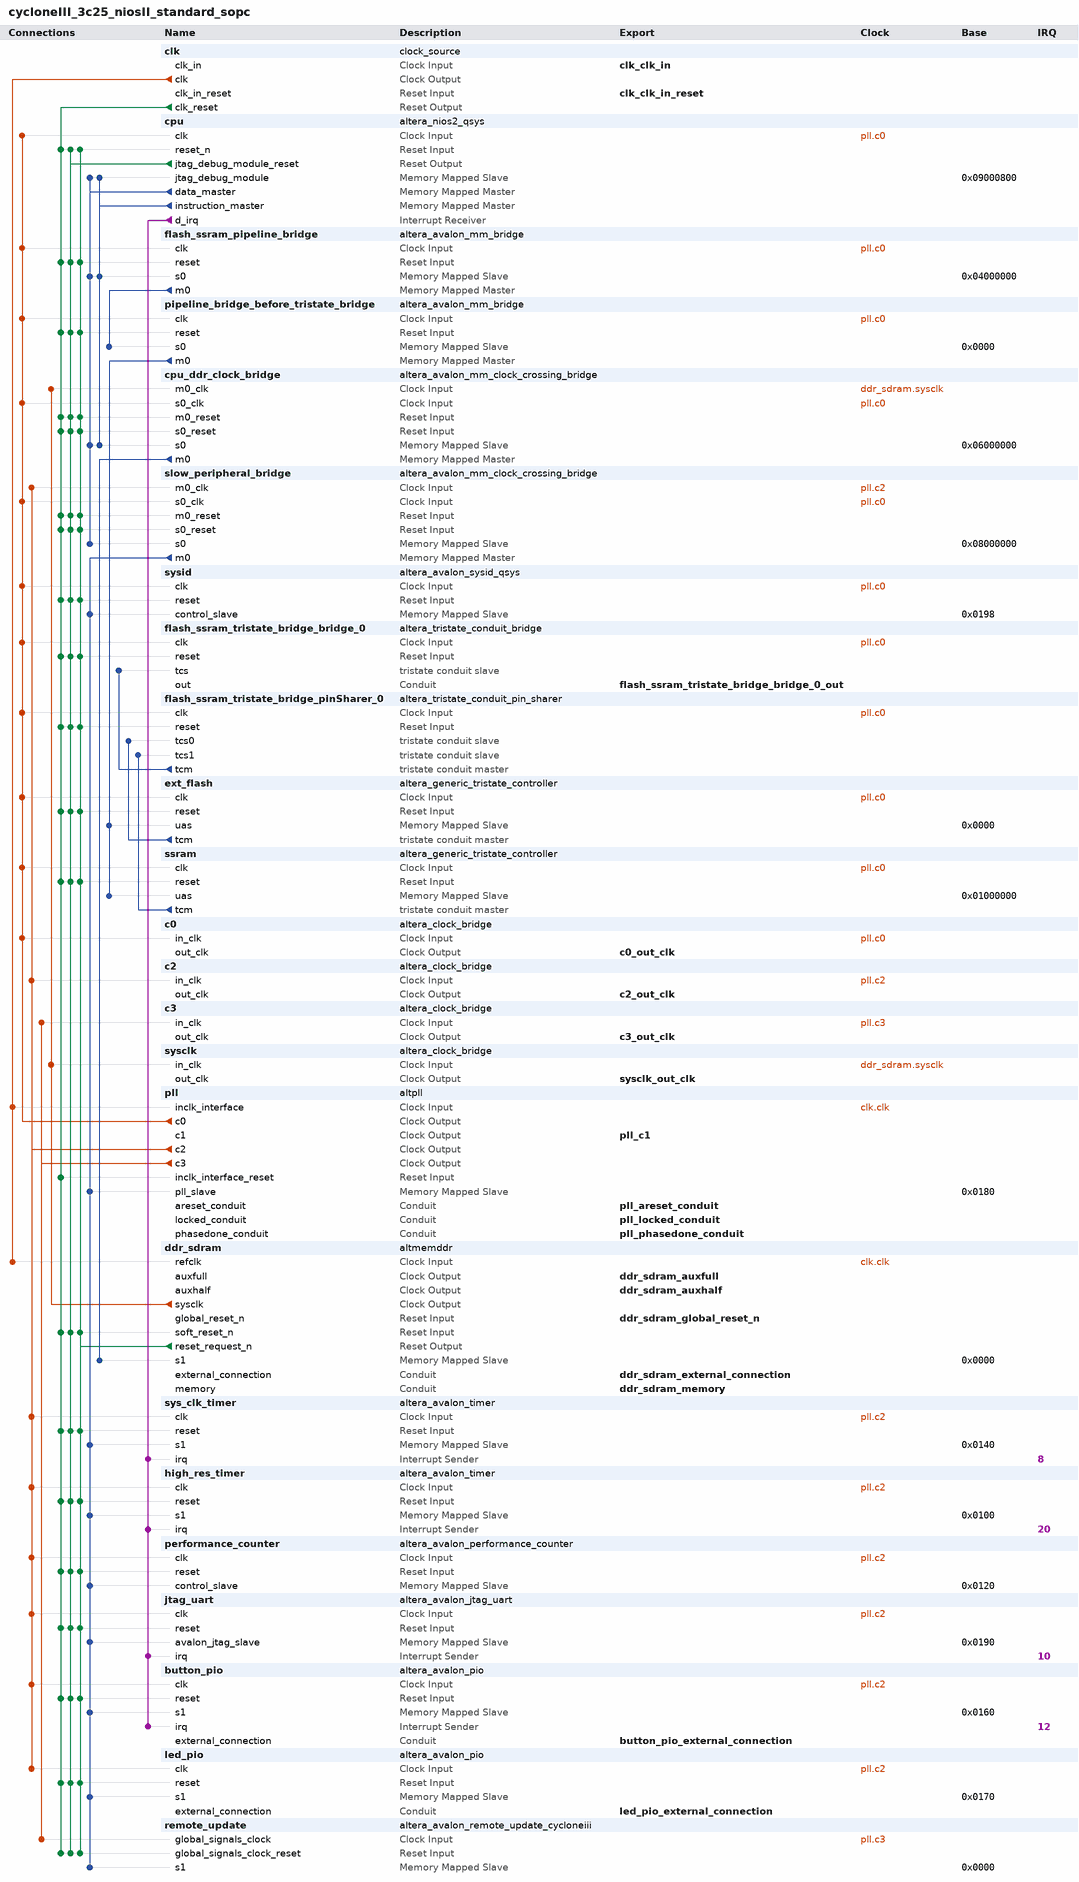
[diagram p0: system contents]
# Platform Designer (Qsys) system cycloneIII_3c25_niosII_standard_sopc
# Parameters at their usual value, and those the tool derives, are not listed.
package require -exact qsys 11.1
create_system cycloneIII_3c25_niosII_standard_sopc
set_project_property DEVICE_FAMILY CYCLONEIII

add_instance clk clock_source 11.1
set_instance_parameter_value clk clockFrequency 50000000

add_instance cpu altera_nios2_qsys 11.1
set_instance_parameter_value cpu manuallyAssignCpuID false
set_instance_parameter_value cpu resetSlave ext_flash.uas
set_instance_parameter_value cpu exceptionSlave ssram.uas
set_instance_parameter_value cpu breakSlave cpu.jtag_debug_module
set_instance_parameter_value cpu impl Fast
set_instance_parameter_value cpu icache_size 4096

add_instance flash_ssram_pipeline_bridge altera_avalon_mm_bridge 11.1
set_instance_parameter_value flash_ssram_pipeline_bridge DATA_WIDTH 32
set_instance_parameter_value flash_ssram_pipeline_bridge ADDRESS_WIDTH 25
set_instance_parameter_value flash_ssram_pipeline_bridge ADDRESS_UNITS SYMBOLS
set_instance_parameter_value flash_ssram_pipeline_bridge MAX_PENDING_RESPONSES 10

add_instance pipeline_bridge_before_tristate_bridge altera_avalon_mm_bridge 11.1
set_instance_parameter_value pipeline_bridge_before_tristate_bridge DATA_WIDTH 32
set_instance_parameter_value pipeline_bridge_before_tristate_bridge ADDRESS_WIDTH 25
set_instance_parameter_value pipeline_bridge_before_tristate_bridge ADDRESS_UNITS SYMBOLS
set_instance_parameter_value pipeline_bridge_before_tristate_bridge MAX_PENDING_RESPONSES 7

add_instance cpu_ddr_clock_bridge altera_avalon_mm_clock_crossing_bridge 11.1
set_instance_parameter_value cpu_ddr_clock_bridge DATA_WIDTH 32
set_instance_parameter_value cpu_ddr_clock_bridge ADDRESS_WIDTH 25
set_instance_parameter_value cpu_ddr_clock_bridge MAX_BURST_SIZE 1
set_instance_parameter_value cpu_ddr_clock_bridge COMMAND_FIFO_DEPTH 8
set_instance_parameter_value cpu_ddr_clock_bridge RESPONSE_FIFO_DEPTH 64
set_instance_parameter_value cpu_ddr_clock_bridge MASTER_SYNC_DEPTH 3
set_instance_parameter_value cpu_ddr_clock_bridge SLAVE_SYNC_DEPTH 3

add_instance slow_peripheral_bridge altera_avalon_mm_clock_crossing_bridge 11.1
set_instance_parameter_value slow_peripheral_bridge DATA_WIDTH 32
set_instance_parameter_value slow_peripheral_bridge ADDRESS_WIDTH 9
set_instance_parameter_value slow_peripheral_bridge MAX_BURST_SIZE 1
set_instance_parameter_value slow_peripheral_bridge COMMAND_FIFO_DEPTH 16
set_instance_parameter_value slow_peripheral_bridge RESPONSE_FIFO_DEPTH 64
set_instance_parameter_value slow_peripheral_bridge MASTER_SYNC_DEPTH 3
set_instance_parameter_value slow_peripheral_bridge SLAVE_SYNC_DEPTH 3

add_instance sysid altera_avalon_sysid_qsys 11.1
set_instance_parameter_value sysid id 0

add_instance flash_ssram_tristate_bridge_bridge_0 altera_tristate_conduit_bridge 11.1

add_instance flash_ssram_tristate_bridge_pinSharer_0 altera_tristate_conduit_pin_sharer 11.1
set_instance_parameter_value flash_ssram_tristate_bridge_pinSharer_0 NUM_INTERFACES 2
set_instance_parameter_value flash_ssram_tristate_bridge_pinSharer_0 MODULE_ORIGIN_LIST ssram.tcm,ssram.tcm,ssram.tcm,ssram.tcm,ssram.tcm,ssram.tcm,ssram.tcm,ssram.tcm,ext_flash.tcm,ext_flash.tcm,ext_flash.tcm,ext_flash.tcm,ext_flash.tcm
set_instance_parameter_value flash_ssram_tristate_bridge_pinSharer_0 SIGNAL_ORIGIN_LIST chipselect_n,byteenable_n,outputenable_n,write_n,data,address,reset_n,begintransfer_n,address,read_n,write_n,data,chipselect_n
set_instance_parameter_value flash_ssram_tristate_bridge_pinSharer_0 SHARED_SIGNAL_LIST chipenable1_n_to_the_ssram,bw_n_to_the_ssram,outputenable_n_to_the_ssram,bwe_n_to_the_ssram,flash_ssram_tristate_bridge_data,flash_ssram_tristate_bridge_address,reset_n_to_the_ssram,adsc_n_to_the_ssram,flash_ssram_tristate_bridge_address,read_n_to_the_ext_flash,write_n_to_the_ext_flash,flash_ssram_tristate_bridge_data,select_n_to_the_ext_flash

add_instance ext_flash altera_generic_tristate_controller 11.1
set_instance_parameter_value ext_flash TCM_ADDRESS_W 24
set_instance_parameter_value ext_flash TCM_DATA_W 16
set_instance_parameter_value ext_flash TCM_BYTEENABLE_W 2
set_instance_parameter_value ext_flash TCM_READ_WAIT 100
set_instance_parameter_value ext_flash TCM_WRITE_WAIT 100
set_instance_parameter_value ext_flash TCM_SETUP_WAIT 25
set_instance_parameter_value ext_flash TCM_DATA_HOLD 20
set_instance_parameter_value ext_flash TCM_MAX_PENDING_READ_TRANSACTIONS 3
set_instance_parameter_value ext_flash TCM_TURNAROUND_TIME 2
set_instance_parameter_value ext_flash TCM_TIMING_UNITS 0
set_instance_parameter_value ext_flash TCM_READLATENCY 2
set_instance_parameter_value ext_flash TCM_SYMBOLS_PER_WORD 2
set_instance_parameter_value ext_flash USE_READ 1
set_instance_parameter_value ext_flash USE_BEGINTRANSFER 0
set_instance_parameter_value ext_flash USE_BYTEENABLE 0
set_instance_parameter_value ext_flash USE_OUTPUTENABLE 0
set_instance_parameter_value ext_flash ACTIVE_LOW_READ 1
set_instance_parameter_value ext_flash ACTIVE_LOW_BYTEENABLE 0
set_instance_parameter_value ext_flash ACTIVE_LOW_OUTPUTENABLE 0
set_instance_parameter_value ext_flash ACTIVE_LOW_BEGINTRANSFER 0
set_instance_parameter_value ext_flash CHIPSELECT_THROUGH_READLATENCY 0
set_instance_parameter_value ext_flash MODULE_ASSIGNMENT_KEYS embeddedsw.configuration.hwClassnameDriverSupportList,embeddedsw.configuration.hwClassnameDriverSupportDefault,embeddedsw.CMacro.SETUP_VALUE,embeddedsw.CMacro.WAIT_VALUE,embeddedsw.CMacro.HOLD_VALUE,embeddedsw.CMacro.TIMING_UNITS,embeddedsw.CMacro.SIZE,embeddedsw.memoryInfo.MEM_INIT_DATA_WIDTH,embeddedsw.memoryInfo.HAS_BYTE_LANE,embeddedsw.memoryInfo.IS_FLASH,embeddedsw.memoryInfo.GENERATE_DAT_SYM,embeddedsw.memoryInfo.GENERATE_FLASH,embeddedsw.memoryInfo.DAT_SYM_INSTALL_DIR,embeddedsw.memoryInfo.FLASH_INSTALL_DIR
set_instance_parameter_value ext_flash MODULE_ASSIGNMENT_VALUES {altera_avalon_lan91c111:altera_avalon_cfi_flash,altera_avalon_cfi_flash,25,100,20,"ns",16777216u,16,1,1,1,1,SIM_DIR,APP_DIR}
set_instance_parameter_value ext_flash INTERFACE_ASSIGNMENT_KEYS embeddedsw.configuration.isFlash,embeddedsw.configuration.isMemoryDevice,embeddedsw.configuration.isNonVolatileStorage
set_instance_parameter_value ext_flash INTERFACE_ASSIGNMENT_VALUES 1,1,1

add_instance ssram altera_generic_tristate_controller 11.1
set_instance_parameter_value ssram TCM_ADDRESS_W 20
set_instance_parameter_value ssram TCM_DATA_W 32
set_instance_parameter_value ssram TCM_BYTEENABLE_W 4
set_instance_parameter_value ssram TCM_READ_WAIT 0
set_instance_parameter_value ssram TCM_WRITE_WAIT 0
set_instance_parameter_value ssram TCM_SETUP_WAIT 0
set_instance_parameter_value ssram TCM_DATA_HOLD 0
set_instance_parameter_value ssram TCM_MAX_PENDING_READ_TRANSACTIONS 5
set_instance_parameter_value ssram TCM_TURNAROUND_TIME 2
set_instance_parameter_value ssram TCM_TIMING_UNITS 1
set_instance_parameter_value ssram TCM_READLATENCY 4
set_instance_parameter_value ssram TCM_SYMBOLS_PER_WORD 4
set_instance_parameter_value ssram USE_READ 0
set_instance_parameter_value ssram USE_BEGINTRANSFER 1
set_instance_parameter_value ssram USE_BYTEENABLE 1
set_instance_parameter_value ssram USE_OUTPUTENABLE 1
set_instance_parameter_value ssram USE_RESET_OUTPUT 1
set_instance_parameter_value ssram ACTIVE_LOW_READ 0
set_instance_parameter_value ssram ACTIVE_LOW_BYTEENABLE 1
set_instance_parameter_value ssram ACTIVE_LOW_OUTPUTENABLE 1
set_instance_parameter_value ssram ACTIVE_LOW_BEGINTRANSFER 1
set_instance_parameter_value ssram ACTIVE_LOW_RESET_OUTPUT 1
set_instance_parameter_value ssram CHIPSELECT_THROUGH_READLATENCY 1
set_instance_parameter_value ssram MODULE_ASSIGNMENT_KEYS embeddedsw.configuration.hwClassnameDriverSupportList,embeddedsw.CMacro.SRAM_MEMORY_SIZE,embeddedsw.CMacro.SRAM_MEMORY_UNITS,embeddedsw.CMacro.SSRAM_DATA_WIDTH,embeddedsw.CMacro.SSRAM_READ_LATENCY,embeddedsw.memoryInfo.MEM_INIT_DATA_WIDTH,embeddedsw.memoryInfo.HAS_BYTE_LANE,embeddedsw.memoryInfo.GENERATE_DAT_SYM,embeddedsw.memoryInfo.DAT_SYM_INSTALL_DIR
set_instance_parameter_value ssram MODULE_ASSIGNMENT_VALUES altera_avalon_lan91c111:altera_avalon_cfi_flash,1,1048576,32,2,32,1,1,SIM_DIR
set_instance_parameter_value ssram INTERFACE_ASSIGNMENT_KEYS embeddedsw.configuration.isMemoryDevice
set_instance_parameter_value ssram INTERFACE_ASSIGNMENT_VALUES 1

add_instance c0 altera_clock_bridge 11.1
set_instance_parameter_value c0 DERIVED_CLOCK_RATE 100000000
set_instance_parameter_value c0 EXPLICIT_CLOCK_RATE 0

add_instance c2 altera_clock_bridge 11.1
set_instance_parameter_value c2 DERIVED_CLOCK_RATE 60000000
set_instance_parameter_value c2 EXPLICIT_CLOCK_RATE 0

add_instance c3 altera_clock_bridge 11.1
set_instance_parameter_value c3 DERIVED_CLOCK_RATE 40000000
set_instance_parameter_value c3 EXPLICIT_CLOCK_RATE 0

add_instance sysclk altera_clock_bridge 11.1
set_instance_parameter_value sysclk DERIVED_CLOCK_RATE 66500000
set_instance_parameter_value sysclk EXPLICIT_CLOCK_RATE 0

add_instance pll altpll 11.1
set_instance_parameter_value pll INCLK0_INPUT_FREQUENCY 20000
set_instance_parameter_value pll OPERATION_MODE NO_COMPENSATION
set_instance_parameter_value pll CLK0_MULTIPLY_BY 2
set_instance_parameter_value pll CLK1_MULTIPLY_BY 2
set_instance_parameter_value pll CLK2_MULTIPLY_BY 6
set_instance_parameter_value pll CLK3_MULTIPLY_BY 4
set_instance_parameter_value pll CLK0_DIVIDE_BY 1
set_instance_parameter_value pll CLK1_DIVIDE_BY 1
set_instance_parameter_value pll CLK2_DIVIDE_BY 5
set_instance_parameter_value pll CLK3_DIVIDE_BY 5
set_instance_parameter_value pll CLK1_PHASE_SHIFT -2000
set_instance_parameter_value pll CLK2_PHASE_SHIFT 0
set_instance_parameter_value pll CLK3_PHASE_SHIFT 0
set_instance_parameter_value pll CLK1_DUTY_CYCLE 50
set_instance_parameter_value pll CLK2_DUTY_CYCLE 50
set_instance_parameter_value pll CLK3_DUTY_CYCLE 50
set_instance_parameter_value pll PORT_clk1 PORT_USED
set_instance_parameter_value pll PORT_clk2 PORT_USED
set_instance_parameter_value pll PORT_clk3 PORT_USED
set_instance_parameter_value pll PORT_ARESET PORT_UNUSED
set_instance_parameter_value pll PORT_LOCKED PORT_UNUSED

add_instance ddr_sdram altmemddr 11.1
set_instance_parameter_value ddr_sdram pipeline_commands false
set_instance_parameter_value ddr_sdram debug_en false
set_instance_parameter_value ddr_sdram export_debug_port false
set_instance_parameter_value ddr_sdram use_generated_memory_model true
set_instance_parameter_value ddr_sdram dedicated_memory_clk_phase_label {Dedicated memory clock phase:}
set_instance_parameter_value ddr_sdram mem_if_clk_mhz 133.0
set_instance_parameter_value ddr_sdram quartus_project_exists false
set_instance_parameter_value ddr_sdram local_if_drate Half
set_instance_parameter_value ddr_sdram enable_v72_rsu false
set_instance_parameter_value ddr_sdram local_if_clk_mhz_label 66.5
set_instance_parameter_value ddr_sdram new_variant true
set_instance_parameter_value ddr_sdram mem_if_memtype {DDR SDRAM}
set_instance_parameter_value ddr_sdram pll_ref_clk_mhz 50.0
set_instance_parameter_value ddr_sdram mem_if_clk_ps_label {(7519 ps)}
set_instance_parameter_value ddr_sdram family {Cyclone III}
set_instance_parameter_value ddr_sdram project_family {Cyclone III}
set_instance_parameter_value ddr_sdram speed_grade 8
set_instance_parameter_value ddr_sdram dedicated_memory_clk_phase 0
set_instance_parameter_value ddr_sdram pll_ref_clk_ps_label {(20000 ps)}
set_instance_parameter_value ddr_sdram avalon_burst_length 1
set_instance_parameter_value ddr_sdram mem_if_clk_pair_count 1
set_instance_parameter_value ddr_sdram mem_if_cs_per_dimm 1
set_instance_parameter_value ddr_sdram pre_latency_label {Fix read latency at:}
set_instance_parameter_value ddr_sdram dedicated_memory_clk_en false
set_instance_parameter_value ddr_sdram mirror_addressing 0
set_instance_parameter_value ddr_sdram mem_if_bankaddr_width 2
set_instance_parameter_value ddr_sdram register_control_word_9 0000
set_instance_parameter_value ddr_sdram mem_if_rowaddr_width 13
set_instance_parameter_value ddr_sdram mem_dyn_deskew_en false
set_instance_parameter_value ddr_sdram post_latency_label {cycles (0 cycles=minimum latency, non-deterministic)}
set_instance_parameter_value ddr_sdram mem_if_dm_pins_en Yes
set_instance_parameter_value ddr_sdram local_if_dwidth_label 64
set_instance_parameter_value ddr_sdram register_control_word_7 0000
set_instance_parameter_value ddr_sdram register_control_word_8 0000
set_instance_parameter_value ddr_sdram mem_if_preset {PSC A2S56D40CTP-G5}
set_instance_parameter_value ddr_sdram mem_if_pchaddr_bit 10
set_instance_parameter_value ddr_sdram WIDTH_RATIO 4
set_instance_parameter_value ddr_sdram vendor Other
set_instance_parameter_value ddr_sdram register_control_word_3 0000
set_instance_parameter_value ddr_sdram register_control_word_4 0000
set_instance_parameter_value ddr_sdram chip_or_dimm {Discrete Device}
set_instance_parameter_value ddr_sdram register_control_word_5 0000
set_instance_parameter_value ddr_sdram register_control_word_6 0000
set_instance_parameter_value ddr_sdram mem_fmax 200.0
set_instance_parameter_value ddr_sdram register_control_word_0 0000
set_instance_parameter_value ddr_sdram register_control_word_size 4
set_instance_parameter_value ddr_sdram register_control_word_1 0000
set_instance_parameter_value ddr_sdram register_control_word_2 0000
set_instance_parameter_value ddr_sdram register_control_word_11 0000
set_instance_parameter_value ddr_sdram register_control_word_10 0000
set_instance_parameter_value ddr_sdram mem_if_cs_width 1
set_instance_parameter_value ddr_sdram mem_if_preset_rlat 0
set_instance_parameter_value ddr_sdram mem_if_cs_per_rank 1
set_instance_parameter_value ddr_sdram fast_simulation_en FAST
set_instance_parameter_value ddr_sdram register_control_word_15 0000
set_instance_parameter_value ddr_sdram register_control_word_14 0000
set_instance_parameter_value ddr_sdram mem_if_dwidth 16
set_instance_parameter_value ddr_sdram mem_if_dq_per_dqs 8
set_instance_parameter_value ddr_sdram mem_if_coladdr_width 9
set_instance_parameter_value ddr_sdram register_control_word_13 0000
set_instance_parameter_value ddr_sdram register_control_word_12 0000
set_instance_parameter_value ddr_sdram mem_tiha_ps 600
set_instance_parameter_value ddr_sdram mem_tdsh_ck 0.2
set_instance_parameter_value ddr_sdram mem_if_trfc_ns 70.0
set_instance_parameter_value ddr_sdram mem_tqh_ck 0.36
set_instance_parameter_value ddr_sdram mem_tisa_ps 600
set_instance_parameter_value ddr_sdram mem_tdss_ck 0.2
set_instance_parameter_value ddr_sdram mem_trtp_ns 0.0
set_instance_parameter_value ddr_sdram mem_if_tinit_us 200.0
set_instance_parameter_value ddr_sdram mem_if_trcd_ns 15.0
set_instance_parameter_value ddr_sdram mem_if_twtr_ck 2
set_instance_parameter_value ddr_sdram mem_trrd_ns 0.0
set_instance_parameter_value ddr_sdram mem_tdqss_ck 0.28
set_instance_parameter_value ddr_sdram mem_tqhs_ps 500
set_instance_parameter_value ddr_sdram mem_tdsa_ps 400
set_instance_parameter_value ddr_sdram mem_tac_ps 700
set_instance_parameter_value ddr_sdram mem_tdha_ps 400
set_instance_parameter_value ddr_sdram mem_if_tras_ns 40.0
set_instance_parameter_value ddr_sdram mem_if_twr_ns 15.0
set_instance_parameter_value ddr_sdram mem_tdqsck_ps 550
set_instance_parameter_value ddr_sdram mem_if_trp_ns 15.0
set_instance_parameter_value ddr_sdram mem_tdqsq_ps 400
set_instance_parameter_value ddr_sdram mem_if_tmrd_ns 10.0
set_instance_parameter_value ddr_sdram mem_tfaw_ns 0.0
set_instance_parameter_value ddr_sdram mem_if_trefi_us 7.0
set_instance_parameter_value ddr_sdram mem_tcl_40_fmax 533.0
set_instance_parameter_value ddr_sdram mem_odt Disabled
set_instance_parameter_value ddr_sdram mp_WLH_percent 0.6
set_instance_parameter_value ddr_sdram mem_drv_str Normal
set_instance_parameter_value ddr_sdram mp_DH_percent 0.5
set_instance_parameter_value ddr_sdram input_period 0
set_instance_parameter_value ddr_sdram mp_QH_percent 0.5
set_instance_parameter_value ddr_sdram mp_QHS_percent 0.5
set_instance_parameter_value ddr_sdram mem_tcl_30_fmax 200.0
set_instance_parameter_value ddr_sdram ac_clk_select 90
set_instance_parameter_value ddr_sdram mp_DQSQ_percent 0.65
set_instance_parameter_value ddr_sdram mp_DS_percent 0.6
set_instance_parameter_value ddr_sdram pll_reconfig_ports_en false
set_instance_parameter_value ddr_sdram mem_btype Sequential
set_instance_parameter_value ddr_sdram mp_IS_percent 0.7
set_instance_parameter_value ddr_sdram mem_tcl 3.0
set_instance_parameter_value ddr_sdram mp_DQSS_percent 0.5
set_instance_parameter_value ddr_sdram export_bank_info false
set_instance_parameter_value ddr_sdram mp_DSS_percent 0.6
set_instance_parameter_value ddr_sdram mem_dll_en Yes
set_instance_parameter_value ddr_sdram ac_phase 90
set_instance_parameter_value ddr_sdram mem_if_oct_en false
set_instance_parameter_value ddr_sdram mem_tcl_60_fmax 533.0
set_instance_parameter_value ddr_sdram mp_DSH_percent 0.6
set_instance_parameter_value ddr_sdram mem_if_dqsn_en false
set_instance_parameter_value ddr_sdram enable_mp_calibration true
set_instance_parameter_value ddr_sdram mp_IH_percent 0.6
set_instance_parameter_value ddr_sdram mem_tcl_15_fmax 533.0
set_instance_parameter_value ddr_sdram dll_external false
set_instance_parameter_value ddr_sdram mem_bl 4
set_instance_parameter_value ddr_sdram mp_WLS_percent 0.7
set_instance_parameter_value ddr_sdram mem_tcl_50_fmax 533.0
set_instance_parameter_value ddr_sdram mp_DQSCK_percent 0.5
set_instance_parameter_value ddr_sdram mem_tcl_25_fmax 200.0
set_instance_parameter_value ddr_sdram mem_tcl_20_fmax 133.333
set_instance_parameter_value ddr_sdram cfg_reorder_data true
set_instance_parameter_value ddr_sdram ctl_ecc_en false
set_instance_parameter_value ddr_sdram ctl_hrb_en false
set_instance_parameter_value ddr_sdram ref_clk_source clk
set_instance_parameter_value ddr_sdram cfg_data_reordering_type INTER_BANK
set_instance_parameter_value ddr_sdram ctl_powerdn_en false
set_instance_parameter_value ddr_sdram multicast_wr_en false
set_instance_parameter_value ddr_sdram auto_powerdn_cycles 0
set_instance_parameter_value ddr_sdram ctl_self_refresh_en false
set_instance_parameter_value ddr_sdram cfg_starve_limit 10
set_instance_parameter_value ddr_sdram ctl_latency 5
set_instance_parameter_value ddr_sdram tool_context SOPC_BUILDER
set_instance_parameter_value ddr_sdram mem_addr_mapping CHIP_ROW_BANK_COL
set_instance_parameter_value ddr_sdram burst_merge_en false
set_instance_parameter_value ddr_sdram user_refresh_en false
set_instance_parameter_value ddr_sdram qsys_mode true
set_instance_parameter_value ddr_sdram clk_source_sharing_en false
set_instance_parameter_value ddr_sdram ctl_lookahead_depth 4
set_instance_parameter_value ddr_sdram ctl_autopch_en false
set_instance_parameter_value ddr_sdram ctl_dynamic_bank_allocation false
set_instance_parameter_value ddr_sdram ctl_dynamic_bank_num 4
set_instance_parameter_value ddr_sdram local_if_type_avalon true
set_instance_parameter_value ddr_sdram csr_en false
set_instance_parameter_value ddr_sdram ctl_auto_correct_en false
set_instance_parameter_value ddr_sdram auto_powerdn_en false
set_instance_parameter_value ddr_sdram phy_if_type_afi true
set_instance_parameter_value ddr_sdram controller_type hp_ctl
set_instance_parameter_value ddr_sdram max_local_size 4
set_instance_parameter_value ddr_sdram mem_srtr Normal
set_instance_parameter_value ddr_sdram mem_mpr_loc {Predefined Pattern}
set_instance_parameter_value ddr_sdram dss_tinit_rst_us 200.0
set_instance_parameter_value ddr_sdram mem_tcl_90_fmax 400.0
set_instance_parameter_value ddr_sdram mem_rtt_wr {Dynamic ODT off}
set_instance_parameter_value ddr_sdram mem_tcl_100_fmax 400.0
set_instance_parameter_value ddr_sdram mem_pasr {Full Array}
set_instance_parameter_value ddr_sdram mem_asrm {Manual SR Reference (SRT)}
set_instance_parameter_value ddr_sdram mem_mpr_oper {Predefined Pattern}
set_instance_parameter_value ddr_sdram mem_tcl_80_fmax 400.0
set_instance_parameter_value ddr_sdram mem_drv_impedance RZQ/7
set_instance_parameter_value ddr_sdram mem_rtt_nom {ODT Disabled}
set_instance_parameter_value ddr_sdram mem_tcl_70_fmax 400.0
set_instance_parameter_value ddr_sdram mem_wtcl 5.0
set_instance_parameter_value ddr_sdram mem_dll_pch {Fast Exit}
set_instance_parameter_value ddr_sdram mem_atcl Disabled
set_instance_parameter_value ddr_sdram board_settings_valid true
set_instance_parameter_value ddr_sdram t_IH 0.6
set_instance_parameter_value ddr_sdram board_intra_DQS_group_skew 0.02
set_instance_parameter_value ddr_sdram isi_DQS 0.0
set_instance_parameter_value ddr_sdram addr_cmd_slew_rate 1.0
set_instance_parameter_value ddr_sdram board_tpd_inter_DIMM 0.05
set_instance_parameter_value ddr_sdram board_addresscmd_CK_skew 0.0
set_instance_parameter_value ddr_sdram t_DS_calculated 0.400
set_instance_parameter_value ddr_sdram isi_addresscmd_hold 0.0
set_instance_parameter_value ddr_sdram t_IS 0.6
set_instance_parameter_value ddr_sdram restore_default_toggle false
set_instance_parameter_value ddr_sdram dqs_dqsn_slew_rate 2.0
set_instance_parameter_value ddr_sdram dq_slew_rate 1.0
set_instance_parameter_value ddr_sdram board_inter_DQS_group_skew 0.02
set_instance_parameter_value ddr_sdram isi_addresscmd_setup 0.0
set_instance_parameter_value ddr_sdram board_minCK_DQS_skew -0.01
set_instance_parameter_value ddr_sdram t_IS_calculated 0.600
set_instance_parameter_value ddr_sdram num_slots_or_devices 1
set_instance_parameter_value ddr_sdram board_maxCK_DQS_skew 0.01
set_instance_parameter_value ddr_sdram board_skew_ps 20
set_instance_parameter_value ddr_sdram t_DH 0.4
set_instance_parameter_value ddr_sdram ck_ckn_slew_rate 2.0
set_instance_parameter_value ddr_sdram isi_DQ 0.0
set_instance_parameter_value ddr_sdram t_IH_calculated 0.600
set_instance_parameter_value ddr_sdram t_DH_calculated 0.400
set_instance_parameter_value ddr_sdram t_DS 0.4

add_instance sys_clk_timer altera_avalon_timer 11.1
set_instance_parameter_value sys_clk_timer period 10.0
set_instance_parameter_value sys_clk_timer periodUnits MSEC
set_instance_parameter_value sys_clk_timer timerPreset FULL_FEATURED

add_instance high_res_timer altera_avalon_timer 11.1
set_instance_parameter_value high_res_timer period 10.0
set_instance_parameter_value high_res_timer periodUnits USEC
set_instance_parameter_value high_res_timer timerPreset FULL_FEATURED

add_instance performance_counter altera_avalon_performance_counter 11.1
set_instance_parameter_value performance_counter numberOfSections 1

add_instance jtag_uart altera_avalon_jtag_uart 11.1
set_instance_parameter_value jtag_uart readBufferDepth 8
set_instance_parameter_value jtag_uart readIRQThreshold 4
set_instance_parameter_value jtag_uart simInteractiveOptions INTERACTIVE_ASCII_OUTPUT
set_instance_parameter_value jtag_uart useRegistersForReadBuffer true
set_instance_parameter_value jtag_uart useRegistersForWriteBuffer true
set_instance_parameter_value jtag_uart writeBufferDepth 8
set_instance_parameter_value jtag_uart writeIRQThreshold 4

add_instance button_pio altera_avalon_pio 11.1
set_instance_parameter_value button_pio captureEdge true
set_instance_parameter_value button_pio direction Input
set_instance_parameter_value button_pio generateIRQ true
set_instance_parameter_value button_pio irqType EDGE
set_instance_parameter_value button_pio simDoTestBenchWiring true
set_instance_parameter_value button_pio simDrivenValue 15
set_instance_parameter_value button_pio width 4

add_instance led_pio altera_avalon_pio 11.1
set_instance_parameter_value led_pio direction Output
set_instance_parameter_value led_pio width 2

add_instance remote_update altera_avalon_remote_update_cycloneiii 10.1
set_instance_parameter_value remote_update clockFrequency 40000000

# connections
add_connection clk.clk ddr_sdram.refclk clock
add_connection clk.clk pll.inclk_interface clock
add_connection ddr_sdram.sysclk cpu_ddr_clock_bridge.m0_clk clock
add_connection ddr_sdram.sysclk sysclk.in_clk clock
add_connection pll.c0 c0.in_clk clock
add_connection pll.c0 cpu.clk clock
add_connection pll.c0 cpu_ddr_clock_bridge.s0_clk clock
add_connection pll.c0 ext_flash.clk clock
add_connection pll.c0 flash_ssram_pipeline_bridge.clk clock
add_connection pll.c0 flash_ssram_tristate_bridge_bridge_0.clk clock
add_connection pll.c0 flash_ssram_tristate_bridge_pinSharer_0.clk clock
add_connection pll.c0 pipeline_bridge_before_tristate_bridge.clk clock
add_connection pll.c0 slow_peripheral_bridge.s0_clk clock
add_connection pll.c0 ssram.clk clock
add_connection pll.c0 sysid.clk clock
add_connection pll.c2 button_pio.clk clock
add_connection pll.c2 c2.in_clk clock
add_connection pll.c2 high_res_timer.clk clock
add_connection pll.c2 jtag_uart.clk clock
add_connection pll.c2 led_pio.clk clock
add_connection pll.c2 performance_counter.clk clock
add_connection pll.c2 slow_peripheral_bridge.m0_clk clock
add_connection pll.c2 sys_clk_timer.clk clock
add_connection pll.c3 c3.in_clk clock
add_connection pll.c3 remote_update.global_signals_clock clock
add_connection clk.clk_reset button_pio.reset reset
add_connection clk.clk_reset cpu.reset_n reset
add_connection clk.clk_reset cpu_ddr_clock_bridge.m0_reset reset
add_connection clk.clk_reset cpu_ddr_clock_bridge.s0_reset reset
add_connection clk.clk_reset ddr_sdram.soft_reset_n reset
add_connection clk.clk_reset ext_flash.reset reset
add_connection clk.clk_reset flash_ssram_pipeline_bridge.reset reset
add_connection clk.clk_reset flash_ssram_tristate_bridge_bridge_0.reset reset
add_connection clk.clk_reset flash_ssram_tristate_bridge_pinSharer_0.reset reset
add_connection clk.clk_reset high_res_timer.reset reset
add_connection clk.clk_reset jtag_uart.reset reset
add_connection clk.clk_reset led_pio.reset reset
add_connection clk.clk_reset performance_counter.reset reset
add_connection clk.clk_reset pipeline_bridge_before_tristate_bridge.reset reset
add_connection clk.clk_reset pll.inclk_interface_reset reset
add_connection clk.clk_reset remote_update.global_signals_clock_reset reset
add_connection clk.clk_reset slow_peripheral_bridge.m0_reset reset
add_connection clk.clk_reset slow_peripheral_bridge.s0_reset reset
add_connection clk.clk_reset ssram.reset reset
add_connection clk.clk_reset sys_clk_timer.reset reset
add_connection clk.clk_reset sysid.reset reset
add_connection cpu.jtag_debug_module_reset button_pio.reset reset
add_connection cpu.jtag_debug_module_reset cpu.reset_n reset
add_connection cpu.jtag_debug_module_reset cpu_ddr_clock_bridge.m0_reset reset
add_connection cpu.jtag_debug_module_reset cpu_ddr_clock_bridge.s0_reset reset
add_connection cpu.jtag_debug_module_reset ddr_sdram.soft_reset_n reset
add_connection cpu.jtag_debug_module_reset ext_flash.reset reset
add_connection cpu.jtag_debug_module_reset flash_ssram_pipeline_bridge.reset reset
add_connection cpu.jtag_debug_module_reset flash_ssram_tristate_bridge_bridge_0.reset reset
add_connection cpu.jtag_debug_module_reset flash_ssram_tristate_bridge_pinSharer_0.reset reset
add_connection cpu.jtag_debug_module_reset high_res_timer.reset reset
add_connection cpu.jtag_debug_module_reset jtag_uart.reset reset
add_connection cpu.jtag_debug_module_reset led_pio.reset reset
add_connection cpu.jtag_debug_module_reset performance_counter.reset reset
add_connection cpu.jtag_debug_module_reset pipeline_bridge_before_tristate_bridge.reset reset
add_connection cpu.jtag_debug_module_reset remote_update.global_signals_clock_reset reset
add_connection cpu.jtag_debug_module_reset slow_peripheral_bridge.m0_reset reset
add_connection cpu.jtag_debug_module_reset slow_peripheral_bridge.s0_reset reset
add_connection cpu.jtag_debug_module_reset ssram.reset reset
add_connection cpu.jtag_debug_module_reset sys_clk_timer.reset reset
add_connection cpu.jtag_debug_module_reset sysid.reset reset
add_connection ddr_sdram.reset_request_n button_pio.reset reset
add_connection ddr_sdram.reset_request_n cpu.reset_n reset
add_connection ddr_sdram.reset_request_n cpu_ddr_clock_bridge.m0_reset reset
add_connection ddr_sdram.reset_request_n cpu_ddr_clock_bridge.s0_reset reset
add_connection ddr_sdram.reset_request_n ddr_sdram.soft_reset_n reset
add_connection ddr_sdram.reset_request_n ext_flash.reset reset
add_connection ddr_sdram.reset_request_n flash_ssram_pipeline_bridge.reset reset
add_connection ddr_sdram.reset_request_n flash_ssram_tristate_bridge_bridge_0.reset reset
add_connection ddr_sdram.reset_request_n flash_ssram_tristate_bridge_pinSharer_0.reset reset
add_connection ddr_sdram.reset_request_n high_res_timer.reset reset
add_connection ddr_sdram.reset_request_n jtag_uart.reset reset
add_connection ddr_sdram.reset_request_n led_pio.reset reset
add_connection ddr_sdram.reset_request_n performance_counter.reset reset
add_connection ddr_sdram.reset_request_n pipeline_bridge_before_tristate_bridge.reset reset
add_connection ddr_sdram.reset_request_n remote_update.global_signals_clock_reset reset
add_connection ddr_sdram.reset_request_n slow_peripheral_bridge.m0_reset reset
add_connection ddr_sdram.reset_request_n slow_peripheral_bridge.s0_reset reset
add_connection ddr_sdram.reset_request_n ssram.reset reset
add_connection ddr_sdram.reset_request_n sys_clk_timer.reset reset
add_connection ddr_sdram.reset_request_n sysid.reset reset
add_connection cpu.data_master cpu.jtag_debug_module avalon
set_connection_parameter_value cpu.data_master/cpu.jtag_debug_module baseAddress 0x09000800
add_connection cpu.data_master cpu_ddr_clock_bridge.s0 avalon
set_connection_parameter_value cpu.data_master/cpu_ddr_clock_bridge.s0 arbitrationPriority 8
set_connection_parameter_value cpu.data_master/cpu_ddr_clock_bridge.s0 baseAddress 0x06000000
add_connection cpu.data_master flash_ssram_pipeline_bridge.s0 avalon
set_connection_parameter_value cpu.data_master/flash_ssram_pipeline_bridge.s0 baseAddress 0x04000000
add_connection cpu.data_master slow_peripheral_bridge.s0 avalon
set_connection_parameter_value cpu.data_master/slow_peripheral_bridge.s0 arbitrationPriority 8
set_connection_parameter_value cpu.data_master/slow_peripheral_bridge.s0 baseAddress 0x08000000
add_connection cpu.instruction_master cpu.jtag_debug_module avalon
set_connection_parameter_value cpu.instruction_master/cpu.jtag_debug_module baseAddress 0x09000800
add_connection cpu.instruction_master cpu_ddr_clock_bridge.s0 avalon
set_connection_parameter_value cpu.instruction_master/cpu_ddr_clock_bridge.s0 arbitrationPriority 8
set_connection_parameter_value cpu.instruction_master/cpu_ddr_clock_bridge.s0 baseAddress 0x06000000
add_connection cpu.instruction_master flash_ssram_pipeline_bridge.s0 avalon
set_connection_parameter_value cpu.instruction_master/flash_ssram_pipeline_bridge.s0 baseAddress 0x04000000
add_connection cpu_ddr_clock_bridge.m0 ddr_sdram.s1 avalon
set_connection_parameter_value cpu_ddr_clock_bridge.m0/ddr_sdram.s1 arbitrationPriority 8
set_connection_parameter_value cpu_ddr_clock_bridge.m0/ddr_sdram.s1 baseAddress 0x0000
add_connection flash_ssram_pipeline_bridge.m0 pipeline_bridge_before_tristate_bridge.s0 avalon
set_connection_parameter_value flash_ssram_pipeline_bridge.m0/pipeline_bridge_before_tristate_bridge.s0 arbitrationPriority 8
set_connection_parameter_value flash_ssram_pipeline_bridge.m0/pipeline_bridge_before_tristate_bridge.s0 baseAddress 0x0000
add_connection pipeline_bridge_before_tristate_bridge.m0 ext_flash.uas avalon
set_connection_parameter_value pipeline_bridge_before_tristate_bridge.m0/ext_flash.uas baseAddress 0x0000
add_connection pipeline_bridge_before_tristate_bridge.m0 ssram.uas avalon
set_connection_parameter_value pipeline_bridge_before_tristate_bridge.m0/ssram.uas baseAddress 0x01000000
add_connection slow_peripheral_bridge.m0 button_pio.s1 avalon
set_connection_parameter_value slow_peripheral_bridge.m0/button_pio.s1 baseAddress 0x0160
add_connection slow_peripheral_bridge.m0 high_res_timer.s1 avalon
set_connection_parameter_value slow_peripheral_bridge.m0/high_res_timer.s1 baseAddress 0x0100
add_connection slow_peripheral_bridge.m0 jtag_uart.avalon_jtag_slave avalon
set_connection_parameter_value slow_peripheral_bridge.m0/jtag_uart.avalon_jtag_slave baseAddress 0x0190
add_connection slow_peripheral_bridge.m0 led_pio.s1 avalon
set_connection_parameter_value slow_peripheral_bridge.m0/led_pio.s1 baseAddress 0x0170
add_connection slow_peripheral_bridge.m0 performance_counter.control_slave avalon
set_connection_parameter_value slow_peripheral_bridge.m0/performance_counter.control_slave baseAddress 0x0120
add_connection slow_peripheral_bridge.m0 pll.pll_slave avalon
set_connection_parameter_value slow_peripheral_bridge.m0/pll.pll_slave baseAddress 0x0180
add_connection slow_peripheral_bridge.m0 remote_update.s1 avalon
set_connection_parameter_value slow_peripheral_bridge.m0/remote_update.s1 baseAddress 0x0000
add_connection slow_peripheral_bridge.m0 sys_clk_timer.s1 avalon
set_connection_parameter_value slow_peripheral_bridge.m0/sys_clk_timer.s1 baseAddress 0x0140
add_connection slow_peripheral_bridge.m0 sysid.control_slave avalon
set_connection_parameter_value slow_peripheral_bridge.m0/sysid.control_slave baseAddress 0x0198
add_connection cpu.d_irq button_pio.irq interrupt
set_connection_parameter_value cpu.d_irq/button_pio.irq irqNumber 12
add_connection cpu.d_irq high_res_timer.irq interrupt
set_connection_parameter_value cpu.d_irq/high_res_timer.irq irqNumber 20
add_connection cpu.d_irq jtag_uart.irq interrupt
set_connection_parameter_value cpu.d_irq/jtag_uart.irq irqNumber 10
add_connection cpu.d_irq sys_clk_timer.irq interrupt
set_connection_parameter_value cpu.d_irq/sys_clk_timer.irq irqNumber 8
add_connection ext_flash.tcm flash_ssram_tristate_bridge_pinSharer_0.tcs0 tristate_conduit
add_connection flash_ssram_tristate_bridge_pinSharer_0.tcm flash_ssram_tristate_bridge_bridge_0.tcs tristate_conduit
add_connection ssram.tcm flash_ssram_tristate_bridge_pinSharer_0.tcs1 tristate_conduit

# exported interfaces
add_interface clk_clk_in_reset reset sink
set_interface_property clk_clk_in_reset EXPORT_OF clk.clk_in_reset
add_interface ddr_sdram_external_connection conduit end
set_interface_property ddr_sdram_external_connection EXPORT_OF ddr_sdram.external_connection
add_interface ddr_sdram_auxhalf clock source
set_interface_property ddr_sdram_auxhalf EXPORT_OF ddr_sdram.auxhalf
add_interface ddr_sdram_auxfull clock source
set_interface_property ddr_sdram_auxfull EXPORT_OF ddr_sdram.auxfull
add_interface c2_out_clk clock source
set_interface_property c2_out_clk EXPORT_OF c2.out_clk
add_interface c0_out_clk clock source
set_interface_property c0_out_clk EXPORT_OF c0.out_clk
add_interface led_pio_external_connection conduit end
set_interface_property led_pio_external_connection EXPORT_OF led_pio.external_connection
add_interface button_pio_external_connection conduit end
set_interface_property button_pio_external_connection EXPORT_OF button_pio.external_connection
add_interface sysclk_out_clk clock source
set_interface_property sysclk_out_clk EXPORT_OF sysclk.out_clk
add_interface flash_ssram_tristate_bridge_bridge_0_out conduit end
set_interface_property flash_ssram_tristate_bridge_bridge_0_out EXPORT_OF flash_ssram_tristate_bridge_bridge_0.out
add_interface ddr_sdram_global_reset_n reset sink
set_interface_property ddr_sdram_global_reset_n EXPORT_OF ddr_sdram.global_reset_n
add_interface clk_clk_in clock sink
set_interface_property clk_clk_in EXPORT_OF clk.clk_in
add_interface ddr_sdram_memory conduit end
set_interface_property ddr_sdram_memory EXPORT_OF ddr_sdram.memory
add_interface c3_out_clk clock source
set_interface_property c3_out_clk EXPORT_OF c3.out_clk
add_interface pll_areset_conduit conduit end
set_interface_property pll_areset_conduit EXPORT_OF pll.areset_conduit
add_interface pll_locked_conduit conduit end
set_interface_property pll_locked_conduit EXPORT_OF pll.locked_conduit
add_interface pll_phasedone_conduit conduit end
set_interface_property pll_phasedone_conduit EXPORT_OF pll.phasedone_conduit
add_interface pll_c1 clock source
set_interface_property pll_c1 EXPORT_OF pll.c1

save_system cycloneIII_3c25_niosII_standard_sopc.qsys
